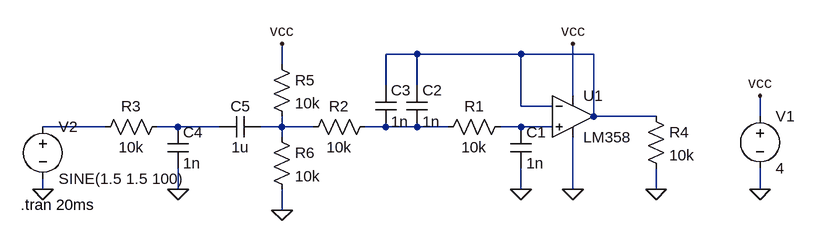
[diagram p0: schematic WAVE_LPF_20170212.asc]
WAVE_LPF_20170212.asc, the LTspice schematic file:
Version 4
SHEET 1 880 680
WIRE 128 48 80 48
WIRE 288 48 128 48
WIRE 400 48 288 48
WIRE -80 64 -80 32
WIRE 80 96 80 48
WIRE 128 96 128 48
WIRE 368 112 368 32
WIRE 288 128 288 48
WIRE 336 128 288 128
WIRE 400 144 400 48
WIRE 496 144 400 144
WIRE 656 144 656 112
WIRE -352 160 -448 160
WIRE -240 160 -272 160
WIRE -176 160 -240 160
WIRE -80 160 -80 144
WIRE -80 160 -112 160
WIRE -32 160 -80 160
WIRE 80 160 48 160
WIRE 128 160 80 160
WIRE 176 160 128 160
WIRE 288 160 256 160
WIRE 336 160 288 160
WIRE -80 176 -80 160
WIRE -448 256 -448 240
WIRE -240 256 -240 224
WIRE 288 256 288 224
WIRE 368 256 368 176
WIRE 496 256 496 224
WIRE 656 256 656 224
WIRE -80 288 -80 256
FLAG -240 256 0
FLAG 288 256 0
FLAG 496 256 0
FLAG 368 256 0
FLAG 656 256 0
FLAG -448 256 0
FLAG 656 112 vcc
FLAG 368 32 vcc
FLAG -80 32 vcc
FLAG -80 288 0
SYMBOL Opamps\\LM358 368 80 R0
SYMATTR InstName U1
SYMBOL res 160 176 R270
WINDOW 0 32 56 VTop 2
WINDOW 3 0 56 VBottom 2
SYMATTR InstName R1
SYMATTR Value 10k
SYMBOL cap 272 160 R0
SYMATTR InstName C1
SYMATTR Value 1n
SYMBOL cap 112 96 R0
SYMATTR InstName C2
SYMATTR Value 1n
SYMBOL cap 64 96 R0
SYMATTR InstName C3
SYMATTR Value 1n
SYMBOL res 64 144 R90
WINDOW 0 0 56 VBottom 2
WINDOW 3 32 56 VTop 2
SYMATTR InstName R2
SYMATTR Value 10k
SYMBOL cap -256 160 R0
SYMATTR InstName C4
SYMATTR Value 1n
SYMBOL res -256 144 R90
WINDOW 0 0 56 VBottom 2
WINDOW 3 32 56 VTop 2
SYMATTR InstName R3
SYMATTR Value 10k
SYMBOL res 480 128 R0
SYMATTR InstName R4
SYMATTR Value 10k
SYMBOL voltage 656 128 R0
WINDOW 123 0 0 Left 2
WINDOW 39 0 0 Left 2
SYMATTR InstName V1
SYMATTR Value 4
SYMBOL voltage -448 144 R0
WINDOW 123 0 0 Left 2
WINDOW 39 0 0 Left 2
SYMATTR InstName V2
SYMATTR Value SINE(1.5 1.5 100)
SYMBOL res -96 48 R0
SYMATTR InstName R5
SYMATTR Value 10k
SYMBOL res -96 160 R0
SYMATTR InstName R6
SYMATTR Value 10k
SYMBOL cap -112 144 R90
WINDOW 0 0 32 VBottom 2
WINDOW 3 32 32 VTop 2
SYMATTR InstName C5
SYMATTR Value 1u
TEXT -482 280 Left 2 !.tran 20ms

The netlist it stands for:
* WAVE_LPF_20170212.asc
XU1 N006 N001 vcc 0 N001 LM358  ; pins In+ In- V+ V- OUT
R1 N005 N006 10k
C1 N006 0 1n
C2 N001 N005 1n
C3 N001 N005 1n
R2 N005 N004 10k
C4 N003 0 1n
R3 N003 N002 10k
R4 N001 0 10k
V1 vcc 0 4
V2 N002 0 SINE(1.5 1.5 100)
R5 vcc N004 10k
R6 N004 0 10k
C5 N004 N003 1u
.tran 20ms
.backanno
.end